# EAGLE design sum-mixer (EAGLE 6.4)
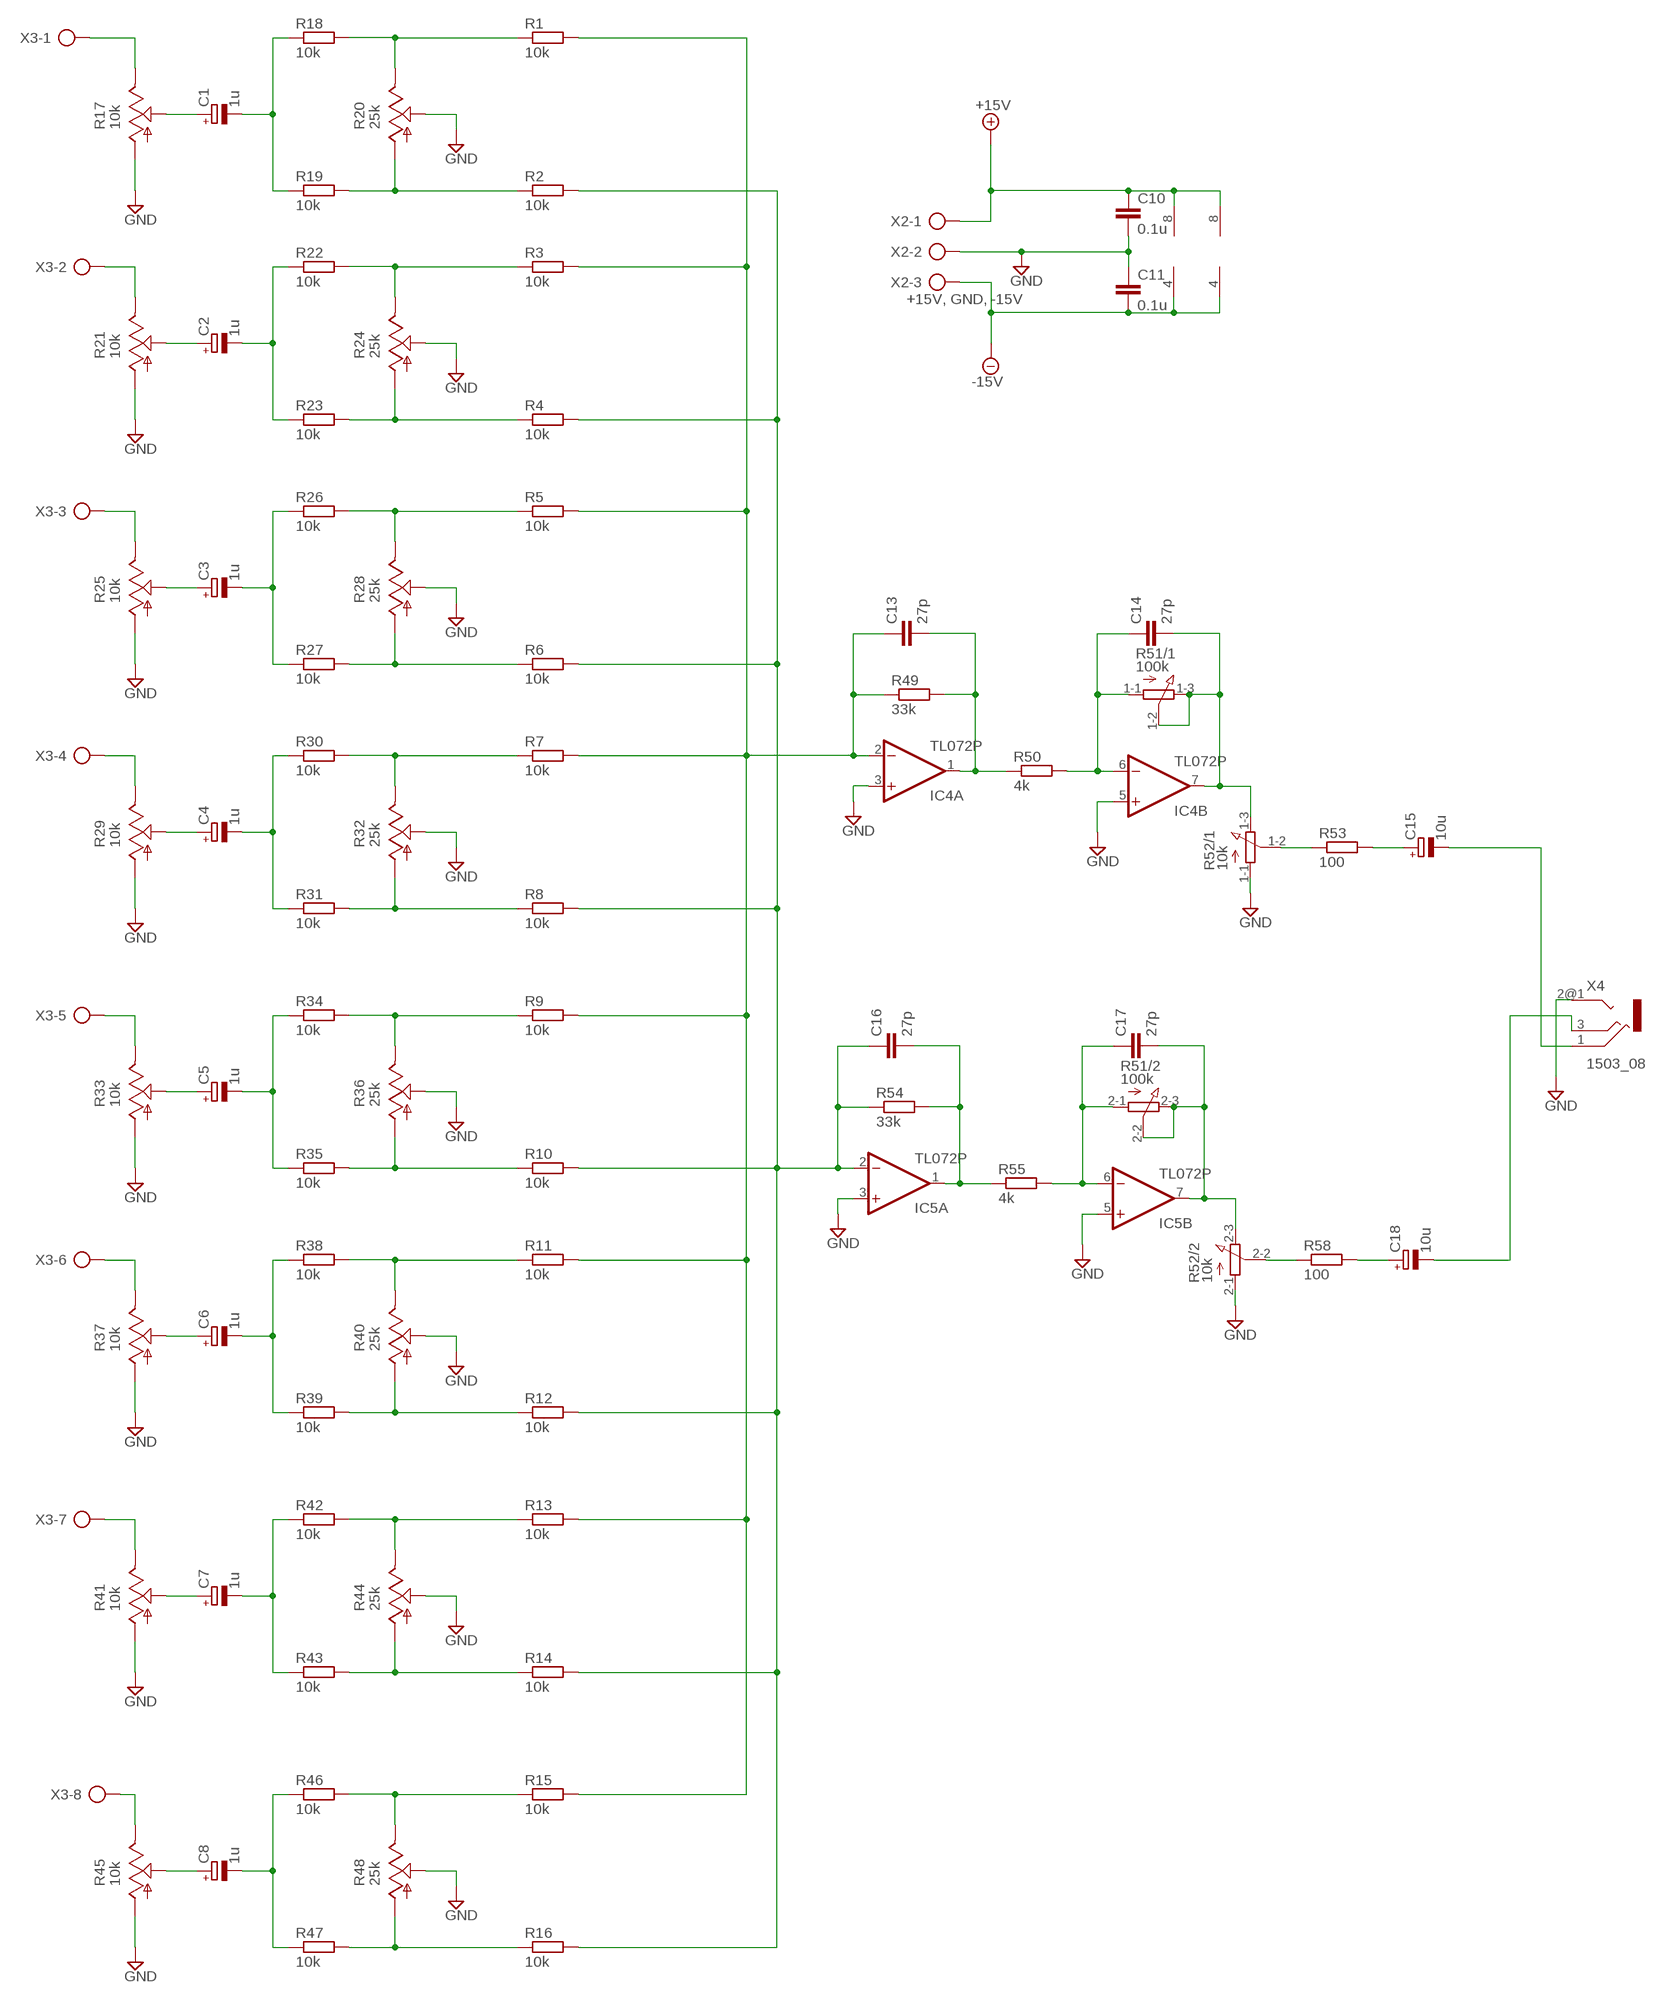
[diagram p0: schematic, sheet 1]

## Parts
C1  1u  CPOL-EUE5-6  [E5-6]
C2  1u  CPOL-EUE5-6  [E5-6]
C3  1u  CPOL-EUE5-6  [E5-6]
C4  1u  CPOL-EUE5-6  [E5-6]
C5  1u  CPOL-EUE5-6  [E5-6]
C6  1u  CPOL-EUE5-6  [E5-6]
C7  1u  CPOL-EUE5-6  [E5-6]
C8  1u  CPOL-EUE5-6  [E5-6]
C10  0.1u  C-EU075-042X103  [C075-042X103]
C11  0.1u  C-EU075-042X103  [C075-042X103]
C13  27p  C-EU025-024X044  [C025-024X044]
C14  27p  C-EU025-024X044  [C025-024X044]
C15  10u  CPOL-EUE5-6  [E5-6]
C16  27p  C-EU025-024X044  [C025-024X044]
C17  27p  C-EU025-024X044  [C025-024X044]
C18  10u  CPOL-EUE5-6  [E5-6]
IC4  TL072P  [DIL08]
IC5  TL072P  [DIL08]
R1  10k  R-EU_0207/5V  [0207/5V]
R2  10k  R-EU_0207/5V  [0207/5V]
R3  10k  R-EU_0207/5V  [0207/5V]
R4  10k  R-EU_0207/5V  [0207/5V]
R5  10k  R-EU_0207/5V  [0207/5V]
R6  10k  R-EU_0207/5V  [0207/5V]
R7  10k  R-EU_0207/5V  [0207/5V]
R8  10k  R-EU_0207/5V  [0207/5V]
R9  10k  R-EU_0207/5V  [0207/5V]
R10  10k  R-EU_0207/5V  [0207/5V]
R11  10k  R-EU_0207/5V  [0207/5V]
R12  10k  R-EU_0207/5V  [0207/5V]
R13  10k  R-EU_0207/5V  [0207/5V]
R14  10k  R-EU_0207/5V  [0207/5V]
R15  10k  R-EU_0207/5V  [0207/5V]
R16  10k  R-EU_0207/5V  [0207/5V]
R17  10k  TRIM_US-B25P  [B25P]
R18  10k  R-EU_0207/5V  [0207/5V]
R19  10k  R-EU_0207/5V  [0207/5V]
R20  25k  TRIM_US-B25P  [B25P]
R21  10k  TRIM_US-B25P  [B25P]
R22  10k  R-EU_0207/5V  [0207/5V]
R23  10k  R-EU_0207/5V  [0207/5V]
R24  25k  TRIM_US-B25P  [B25P]
R25  10k  TRIM_US-B25P  [B25P]
R26  10k  R-EU_0207/5V  [0207/5V]
R27  10k  R-EU_0207/5V  [0207/5V]
R28  25k  TRIM_US-B25P  [B25P]
R29  10k  TRIM_US-B25P  [B25P]
R30  10k  R-EU_0207/5V  [0207/5V]
R31  10k  R-EU_0207/5V  [0207/5V]
R32  25k  TRIM_US-B25P  [B25P]
R33  10k  TRIM_US-B25P  [B25P]
R34  10k  R-EU_0207/5V  [0207/5V]
R35  10k  R-EU_0207/5V  [0207/5V]
R36  25k  TRIM_US-B25P  [B25P]
R37  10k  TRIM_US-B25P  [B25P]
R38  10k  R-EU_0207/5V  [0207/5V]
R39  10k  R-EU_0207/5V  [0207/5V]
R40  25k  TRIM_US-B25P  [B25P]
R41  10k  TRIM_US-B25P  [B25P]
R42  10k  R-EU_0207/5V  [0207/5V]
R43  10k  R-EU_0207/5V  [0207/5V]
R44  25k  TRIM_US-B25P  [B25P]
R45  10k  TRIM_US-B25P  [B25P]
R46  10k  R-EU_0207/5V  [0207/5V]
R47  10k  R-EU_0207/5V  [0207/5V]
R48  25k  TRIM_US-B25P  [B25P]
R49  33k  R-EU_0207/5V  [0207/5V]
R50  4k  R-EU_0207/5V  [0207/5V]
R51  100k  3RP/1610G  [3RP/1610G]
R52  10k  3RP/1610G  [3RP/1610G]
R53  100  R-EU_0207/5V  [0207/5V]
R54  33k  R-EU_0207/5V  [0207/5V]
R55  4k  R-EU_0207/5V  [0207/5V]
R58  100  R-EU_0207/5V  [0207/5V]
X2  +15V, GND, -15V  AK300/3  [AK300/3]
X3  AK300/8  [AK300/8]
X4  1503_08  [1503_08]

## Nets
+15V: C10.1 IC4.8(P:V+) IC5.8(P:V+) X2.1
-15V: C11.2 IC4.4(P:V-) IC5.4(P:V-) X2.3
GND: C10.2 C11.1 IC4.3(A:+IN) IC4.5(B:+IN) IC5.3(A:+IN) IC5.5(B:+IN) R17.A R20.S R21.A R24.S R25.A R28.S R29.A R32.S R33.A R36.S R37.A R40.S R41.A R44.S R45.A R48.S R52.1-1(/1:A) R52.2-1(/2:A) X2.2 X4.2@1
N$1: R1.1 R18.2 R20.E
N$2: R2.1 R19.2 R20.A
N$3: R3.1 R22.2 R24.E
N$4: R4.1 R23.2 R24.A
N$5: R5.1 R26.2 R28.E
N$6: R6.1 R27.2 R28.A
N$7: R7.1 R30.2 R32.E
N$8: R8.1 R31.2 R32.A
N$9: R9.1 R34.2 R36.E
N$10: R10.1 R35.2 R36.A
N$11: R11.1 R38.2 R40.E
N$12: R12.1 R39.2 R40.A
N$13: R13.1 R42.2 R44.E
N$14: R14.1 R43.2 R44.A
N$15: R15.1 R46.2 R48.E
N$16: R16.1 R47.2 R48.A
N$17: C1.+ R17.S
N$18: C2.+ R21.S
N$19: C3.+ R25.S
N$20: C1.- R18.1 R19.1
N$21: C4.+ R29.S
N$22: C5.+ R33.S
N$23: R17.E X3.1
N$24: C2.- R22.1 R23.1
N$25: C6.+ R37.S
N$26: C7.+ R41.S
N$27: R21.E X3.2
N$28: C3.- R26.1 R27.1
N$29: C8.+ R45.S
N$31: R25.E X3.3
N$32: C4.- R30.1 R31.1
N$35: R29.E X3.4
N$36: C5.- R34.1 R35.1
N$39: R33.E X3.5
N$40: C6.- R38.1 R39.1
N$43: R37.E X3.6
N$44: C7.- R42.1 R43.1
N$47: R41.E X3.7
N$48: C8.- R46.1 R47.1
N$49: C16.1 IC5.2(A:-IN) R2.2 R4.2 R6.2 R8.2 R10.2 R12.2 R14.2 R16.2 R54.1
N$50: C13.1 IC4.2(A:-IN) R1.2 R3.2 R5.2 R7.2 R9.2 R11.2 R13.2 R15.2 R49.1
N$51: R45.E X3.8
N$53: C13.2 IC4.1(A:OUT) R49.2 R50.1
N$54: C14.1 IC4.6(B:-IN) R50.2 R51.1-1(/1:A)
N$55: C14.2 IC4.7(B:OUT) R51.1-2(/1:S) R51.1-3(/1:E) R52.1-3(/1:E)
N$56: R52.1-2(/1:S) R53.1
N$57: C15.+ R53.2
N$58: C18.- X4.3
N$60: C16.2 IC5.1(A:OUT) R54.2 R55.1
N$61: C17.1 IC5.6(B:-IN) R51.2-1(/2:A) R55.2
N$62: C17.2 IC5.7(B:OUT) R51.2-2(/2:S) R51.2-3(/2:E) R52.2-3(/2:E)
N$63: R52.2-2(/2:S) R58.1
N$64: C18.+ R58.2
N$65: C15.- X4.1
Unconnected: X4.2@2

## Library data of the parts
C1-C8 C15 C18 = rcl:CPOL-EU: POLARIZED CAPACITOR, European symbol
C10 C11 C13 C14 C16 C17 = rcl:C-EU: CAPACITOR, European symbol
IC4 IC5 = linear:TL072: OP AMP
R1-R16 R18 R19 R22 R23 R26 R27 R30 R31 R34 R35 R38 R39 R42 R43 R46 R47 R49 R50 R53-R55 R58 = rcl:R-EU_: RESISTOR, European symbol
R17 R20 R21 R24 R25 R28 R29 R32 R33 R36 R37 R40 R41 R44 R45 R48 = pot:TRIM_US-: POTENTIOMETER
R51 R52 = pot:3RP/1610G: 16mm Potentiometer two level Source: http://www.alphapotentiometers.net/html/16mm_pot_2.html
X2 = con-ptr500:AK300/3: CONNECTOR; OC_FARNELL: unknown; OC_NEWARK: unknown
X3 = con-ptr500:AK300/8: CONNECTOR; OC_FARNELL: unknown; OC_NEWARK: unknown
X4 = con-lumberg:1503_?: Jack connectors according to JISC 6560, 3.5 mm Klinkensteckverbinder nach JISC 6560, 3,5 mm Source: http://www.lumberg.com/Produkte/PDFs/1503_08.pdf; OC_FARNELL: unknown; OC_NEWARK: unknown

## Board
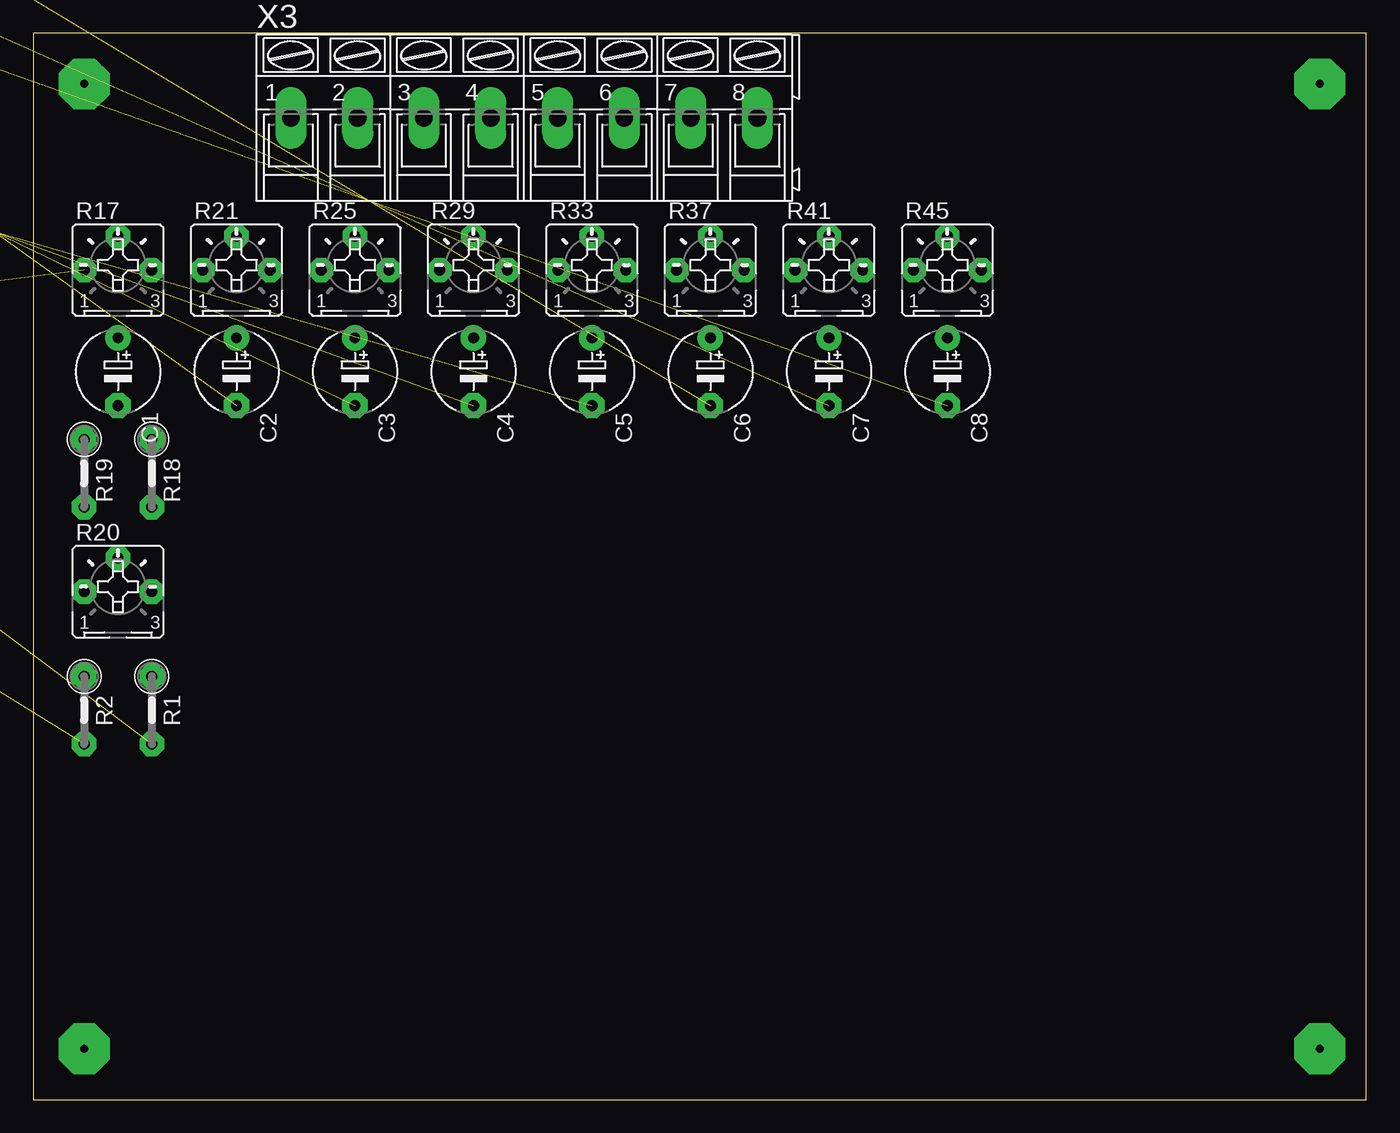
[diagram p1: board, top side]
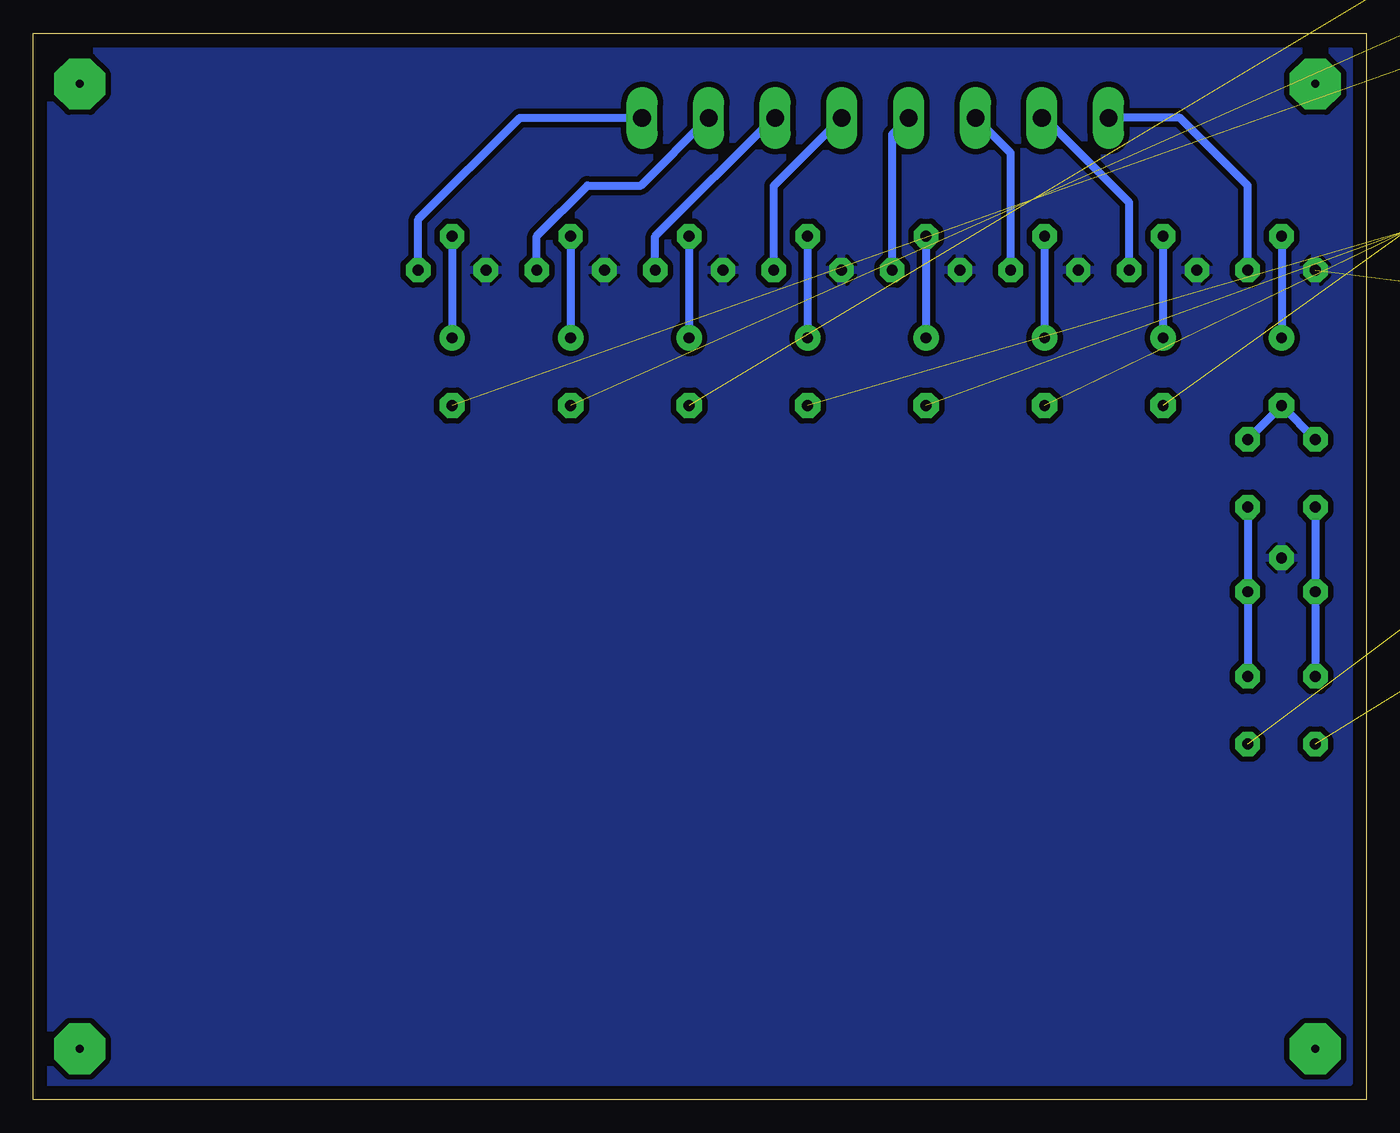
[diagram p2: board, bottom side, seen from below]

Size 100 x 80 mm. Coordinates in mm from the lower left corner, seen from the top.
Outline: 0,0 100,0 100,80 0,80 0,0
Copper layers (1*16): Top 0.035mm / dielectric 1.5mm / Bottom 0.035mm
Design rules "default *": minimum track width 10mil, minimum drill 24mil, track to track 8mil, track to pad 8mil, pad to pad 8mil, via to via 8mil, smd to smd 8mil, copper to edge 40mil, drill to drill 8mil, minimum pad ring 10mil, minimum via ring 8mil, stop-mask expansion 4mil, vias tented up to drill 0mil, thermal gap 10mil

### Footprints (pad centres in the part's own frame; a part is rotated, then mirrored left to right if it is on the bottom)
E5-6 = drill 0.813 pad 1.905: + -2.54,0 | drill 0.813 pad 1.905 octagon: - 2.54,0
C075-042X103 = drill 0.914 octagon: 1 -3.81,0; 2 3.81,0
C025-024X044 = drill 0.813 octagon: 1 -1.27,0; 2 1.27,0
DIL08 = drill 0.813 pad 1.27: 1 -3.81,-3.81; 2 -1.27,-3.81; 3 1.27,-3.81; 4 3.81,-3.81; 5 3.81,3.81; 6 1.27,3.81; 7 -1.27,3.81; 8 -3.81,3.81
0207/5V = drill 0.813 octagon: 1 -2.54,0; 2 2.54,0
B25P = drill 0.813 octagon: A -2.54,0; E 2.54,0; S 0,2.54
3RP/1610G = drill 1.2 pad 2.184: 1-1 -5,0; 1-2 0,0; 1-3 5,0; 2-1 -5,5; 2-2 0,5; 2-3 5,5
AK300/3 = drill 1.321 long: 1 -5.004,0; 2 0,0; 3 5.004,0
AK300/8 = drill 1.321 long: 1 -17.501,0; 2 -12.497,0; 3 -7.518,0; 4 -2.515,0; 5 2.515,0; 6 7.518,0; 7 12.497,0; 8 17.501,0
1503_08 = drill 1 pad 1.2 long: 1 -2.9,-8; 2@1 -3.2,0; 2@2 3.2,0; 3 2.9,-8 | hole 1.2: 0,4.5; 0,-5.5

### Placement (x,y rotation side)
C1  6.35,54.61 270 top
C2  15.24,54.61 270 top
C3  24.13,54.61 270 top
C4  33.02,54.61 270 top
C5  41.91,54.61 270 top
C6  50.8,54.61 270 top
C7  59.69,54.61 270 top
C8  68.58,54.61 270 top
C10  -78.74,66.04 0 top  (outside the outline)
C11  -19.05,73.66 0 top  (outside the outline)
C13  -26.67,74.93 0 top  (outside the outline)
C14  -31.75,74.93 0 top  (outside the outline)
C15  -52.07,55.88 0 top  (outside the outline)
C16  -36.83,74.93 0 top  (outside the outline)
C17  -41.91,74.93 0 top  (outside the outline)
C18  -63.5,55.88 0 top  (outside the outline)
IC4  -25.4,57.15 0 top  (outside the outline)
IC5  -38.1,57.15 0 top  (outside the outline)
R1  8.89,29.21 270 top
R2  3.81,29.21 270 top
R3  -63.5,73.66 0 top  (outside the outline)
R4  -71.12,73.66 0 top  (outside the outline)
R5  -78.74,73.66 0 top  (outside the outline)
R6  -86.36,73.66 0 top  (outside the outline)
R7  -16.51,81.28 0 top  (outside the outline)
R8  -24.13,81.28 0 top  (outside the outline)
R9  -31.75,81.28 0 top  (outside the outline)
R10  -39.37,81.28 0 top  (outside the outline)
R11  -46.99,81.28 0 top  (outside the outline)
R12  -54.61,81.28 0 top  (outside the outline)
R13  -62.23,81.28 0 top  (outside the outline)
R14  -69.85,81.28 0 top  (outside the outline)
R15  -77.47,81.28 0 top  (outside the outline)
R16  -85.09,81.28 0 top  (outside the outline)
R17  6.35,62.23 0 top
R18  8.89,46.99 270 top
R19  3.81,46.99 270 top
R20  6.35,38.1 0 top
R21  15.24,62.23 0 top
R22  -31.75,87.63 0 top  (outside the outline)
R23  -39.37,87.63 0 top  (outside the outline)
R24  -82.55,30.48 0 top  (outside the outline)
R25  24.13,62.23 0 top
R26  -46.99,87.63 0 top  (outside the outline)
R27  -54.61,87.63 0 top  (outside the outline)
R28  -16.51,45.72 0 top  (outside the outline)
R29  33.02,62.23 0 top
R30  -62.23,87.63 0 top  (outside the outline)
R31  -69.85,87.63 0 top  (outside the outline)
R32  -31.75,45.72 0 top  (outside the outline)
R33  41.91,62.23 0 top
R34  -77.47,87.63 0 top  (outside the outline)
R35  -85.09,87.63 0 top  (outside the outline)
R36  -46.99,45.72 0 top  (outside the outline)
R37  50.8,62.23 0 top
R38  -16.51,93.98 0 top  (outside the outline)
R39  -24.13,93.98 0 top  (outside the outline)
R40  -62.23,45.72 0 top  (outside the outline)
R41  59.69,62.23 0 top
R42  -31.75,93.98 0 top  (outside the outline)
R43  -39.37,93.98 0 top  (outside the outline)
R44  -77.47,45.72 0 top  (outside the outline)
R45  68.58,62.23 0 top
R46  -46.99,93.98 0 top  (outside the outline)
R47  -54.61,93.98 0 top  (outside the outline)
R48  -16.51,57.15 0 top  (outside the outline)
R49  -62.23,93.98 0 top  (outside the outline)
R50  -69.85,93.98 0 top  (outside the outline)
R51  -21.59,13.97 0 top  (outside the outline)
R52  -39.37,13.97 0 top  (outside the outline)
R53  -77.47,93.98 0 top  (outside the outline)
R54  -85.09,93.98 0 top  (outside the outline)
R55  -16.51,100.33 0 top  (outside the outline)
R58  -24.13,100.33 0 top  (outside the outline)
X2  -62.23,10.16 0 top  (outside the outline)
X3  36.83,73.66 0 top
X4  -76.2,10.16 0 top  (outside the outline)

### Tracks (layer width: path | path; a pad name or v marks a point on that pad's centre or on a via)
+15V  (3 unrouted)
-15V  (3 unrouted)
GND  (17 unrouted)
  pour Bottom (isolate 0.406): 1.27,78.74 1.27,1.27 99.06,1.27 99.06,78.74
N$1
  Bottom 0.61: R18.2 R20.E R1.1
N$2
  Bottom 0.61: R19.2 R20.A R2.1
N$3  (2 unrouted)
N$4  (2 unrouted)
N$5  (2 unrouted)
N$6  (2 unrouted)
N$7  (2 unrouted)
N$8  (2 unrouted)
N$9  (2 unrouted)
N$10  (2 unrouted)
N$11  (2 unrouted)
N$12  (2 unrouted)
N$13  (2 unrouted)
N$14  (2 unrouted)
N$15  (2 unrouted)
N$16  (2 unrouted)
N$17
  Bottom 0.61: R17.S C1.+
N$18
  Bottom 0.61: R21.S C2.+
N$19
  Bottom 0.61: R25.S C3.+
N$20
  Bottom 0.61: R19.1 C1.- R18.1
N$21
  Bottom 0.61: R29.S C4.+
N$22
  Bottom 0.61: R33.S C5.+
N$23
  Bottom 0.61: R17.E 8.89,68.58 13.97,73.66 X3.1
N$24  (2 unrouted)
N$25
  Bottom 0.61: R37.S C6.+
N$26
  Bottom 0.61: R41.S C7.+
N$27
  Bottom 0.61: R21.E 17.78,67.31 24.13,73.66 X3.2
N$28  (2 unrouted)
N$29
  Bottom 0.61: R45.S C8.+
N$30  (via drill 0.6 pad 3.81)
  other vias: 3.81,76.2
N$31
  Bottom 0.61: R25.E 26.67,71.02 X3.3
N$32  (2 unrouted)
N$33  (via drill 0.6 pad 3.81)
  other vias: 96.52,76.2
N$34  (via drill 0.6 pad 3.81)
  other vias: 96.52,3.81
N$35
  Bottom 0.61: R29.E 35.56,72.42 X3.4
N$36  (2 unrouted)
N$37  (via drill 0.6 pad 3.81)
  other vias: 3.81,3.81
N$39
  Bottom 0.61: R33.E 44.45,68.56 X3.5
N$40  (2 unrouted)
N$43
  Bottom 0.61: R37.E 53.34,64.77 44.45,73.66 X3.6
N$44  (2 unrouted)
N$47
  Bottom 0.61: R41.E 62.23,64.77 58.42,68.58 54.41,68.58 X3.7
N$48  (2 unrouted)
N$49  (10 unrouted)
N$50  (10 unrouted)
N$51
  Bottom 0.61: R45.E 71.12,66.04 63.5,73.66 X3.8
N$53  (3 unrouted)
N$54  (3 unrouted)
N$55  (4 unrouted)
N$56  (1 unrouted)
N$57  (1 unrouted)
N$58  (1 unrouted)
N$60  (3 unrouted)
N$61  (3 unrouted)
N$62  (4 unrouted)
N$63  (1 unrouted)
N$64  (1 unrouted)
N$65  (1 unrouted)